# EAGLE design Radio Board (EAGLE 6.1)
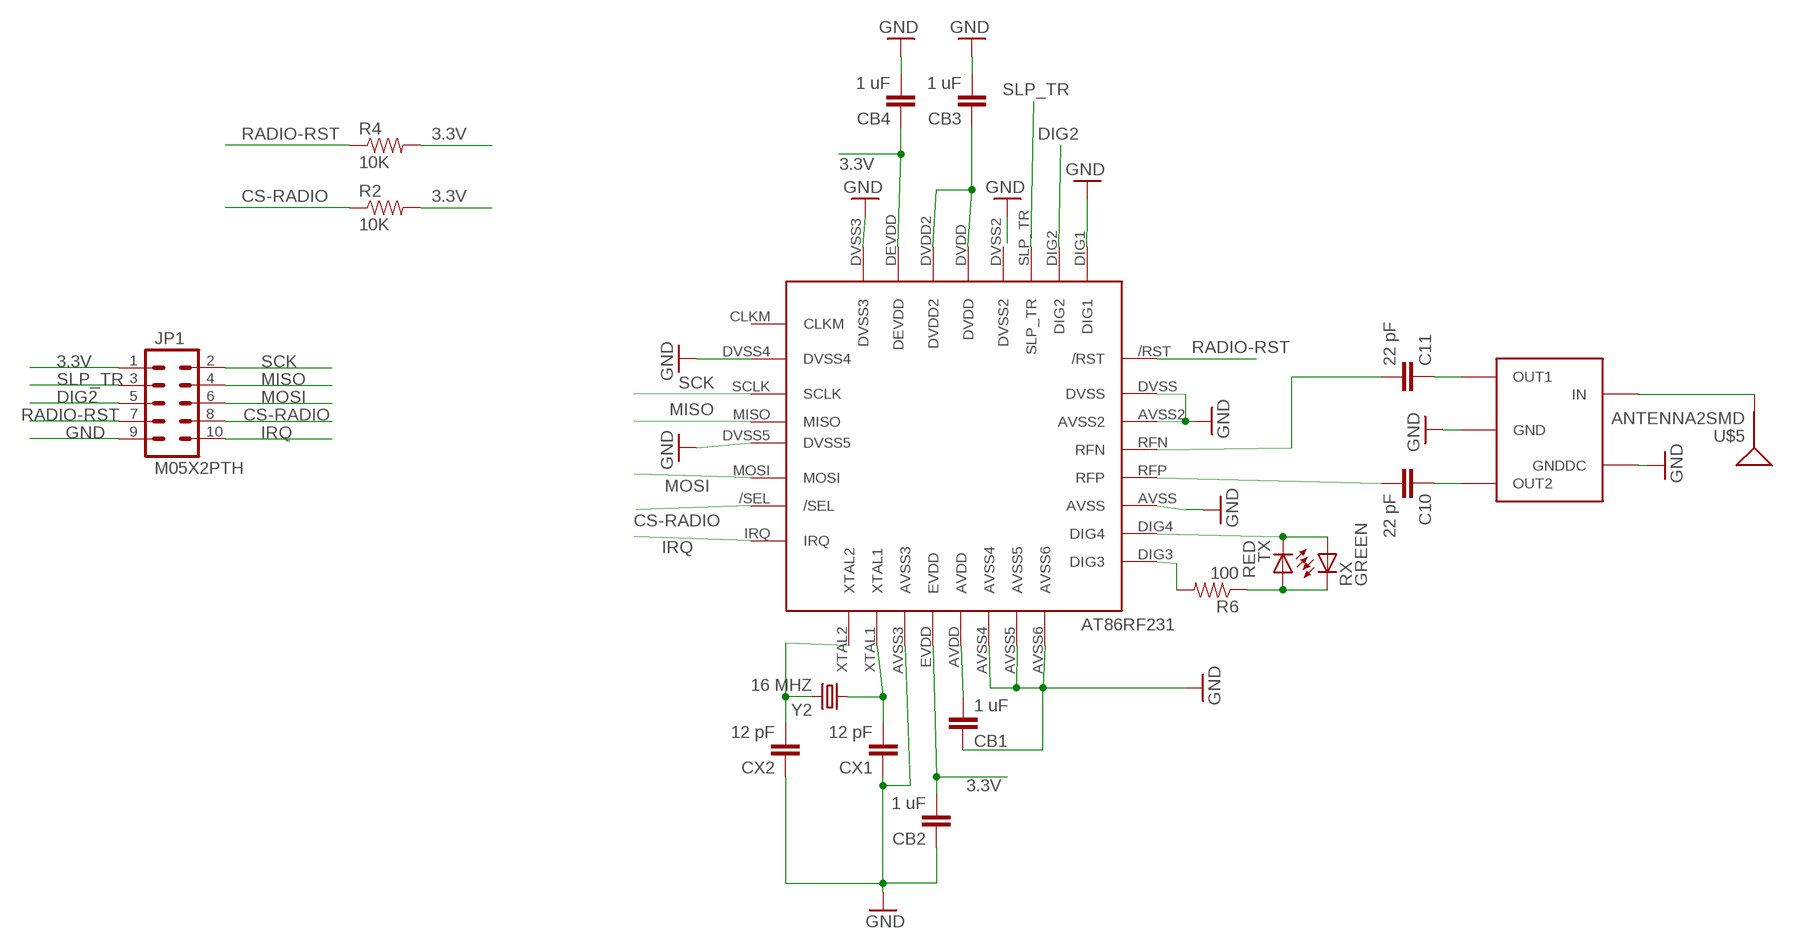
[diagram p0: schematic, sheet 1]

## Parts
C10  22 pF  CAP0603-CAP  [0603-CAP]
C11  22 pF  CAP0603-CAP  [0603-CAP]
CB1  1 uF  CAP0603-CAP  [0603-CAP]
CB2  1 uF  CAP0603-CAP  [0603-CAP]
CB3  1 uF  CAP0603-CAP  [0603-CAP]
CB4  1 uF  CAP0603-CAP  [0603-CAP]
CX1  12 pF  CAP0603-CAP  [0603-CAP]
CX2  12 pF  CAP0603-CAP  [0603-CAP]
JP1  M05X2PTH  [AVR_ICSP]
R2  10K  RESISTOR0603-RES  [0603-RES]
R4  10K  RESISTOR0603-RES  [0603-RES]
R6  100  RESISTOR0603-RES  [0603-RES]
RX  GREEN  LED0603  [LED-0603]
TX  RED  LED0603  [LED-0603]
U$3  AT86RF231(RADIO)AT86RF231  [32QN2(RADIO)]
U$4  WE-BAL  [WE-BAL]
U$5  ANTENNA2SMD  [ANTENNA-CHIP2]
Y2  16 MHZ  CRYSTALSMD  [HC49UP]

## Nets
3.3V: CB2.2 CB4.1 JP1.1 R2.2 R4.2 U$3.DEVDD U$3.EVDD
CS-RADIO: JP1.8 R2.1 U$3./SEL
DIG2: JP1.5 U$3.DIG2
GND: CB1.1 CB2.1 CB3.2 CB4.2 CX1.1 CX2.1 JP1.9 U$3.AVSS U$3.AVSS2 U$3.AVSS3 U$3.AVSS4 U$3.AVSS5 U$3.AVSS6 U$3.DIG1 U$3.DVSS U$3.DVSS3 U$3.DVSS4 U$3.DVSS5 U$4.GND U$4.GNDDC
IRQ: JP1.10 U$3.IRQ
MISO: JP1.4 U$3.MISO
MOSI: JP1.6 U$3.MOSI
N$9: CB3.1 U$3.DVDD U$3.DVDD2
N$10: CB1.2 U$3.AVDD
N$11: CX1.2 U$3.XTAL1 Y2.1
N$12: CX2.2 U$3.XTAL2 Y2.2
N$13: RX.A TX.C U$3.DIG4
N$14: R6.1 RX.C TX.A
N$15: R6.2 U$3.DIG3
N$16: C10.1 U$4.OUT2
N$17: C11.1 U$4.OUT1
N$18: C11.2 U$3.RFN
N$19: C10.2 U$3.RFP
N$20: U$4.IN U$5.FEED(SIGNAL)
RADIO-RST: JP1.7 R4.1 U$3./RST
SCK: JP1.2 U$3.SCLK
SLP_TR: JP1.3 U$3.SLP_TR
Unconnected: U$3.CLKM U$3.DVSS2

## Library data of the parts
C10 C11 CB1-CB4 CX1 CX2 = SparkFun:CAP: Capacitor Standard 0603 ceramic capacitor, and 0.1" leaded capacitor.
JP1 = SparkFun:M05X2: Header 5x2 Standard 10-pin dual row 0.1" header. Commonly used with AVR-ISP. Use with Spark Fun Electronics SKU: PRT-00778
R2 R4 R6 = SparkFun:RESISTOR: Resistor Basic schematic elements and footprints for 0603, 1206, and PTH resistors.
RX TX = SparkFun:LED: LEDs Standard schematic elements and footprints for 5mm, 3mm, 1206, and 0603 sized LEDs. 5mm - Spark Fun Electronics SKU : COM-00529 (and others)
U$3 = group10:AT86RF231(RADIO)
U$4 = group10:WE-BAL
U$5 = SparkFun:ANTENNA2: Antenna Single endded antenna. Common with smaller chip antennas. CHIP4 package is the GPS Chip Antenna SKU: GPS-08418. CHIP5 package is 2.4GHz chip antenna SKU: WRL-00144.
Y2 = group10:CRYSTAL: Crystals Various standard crystals. Proven footprints. Spark Fun Electronics SKU : COM-00534

## Net classes
1 Mini: width 0.25 mm

## Board
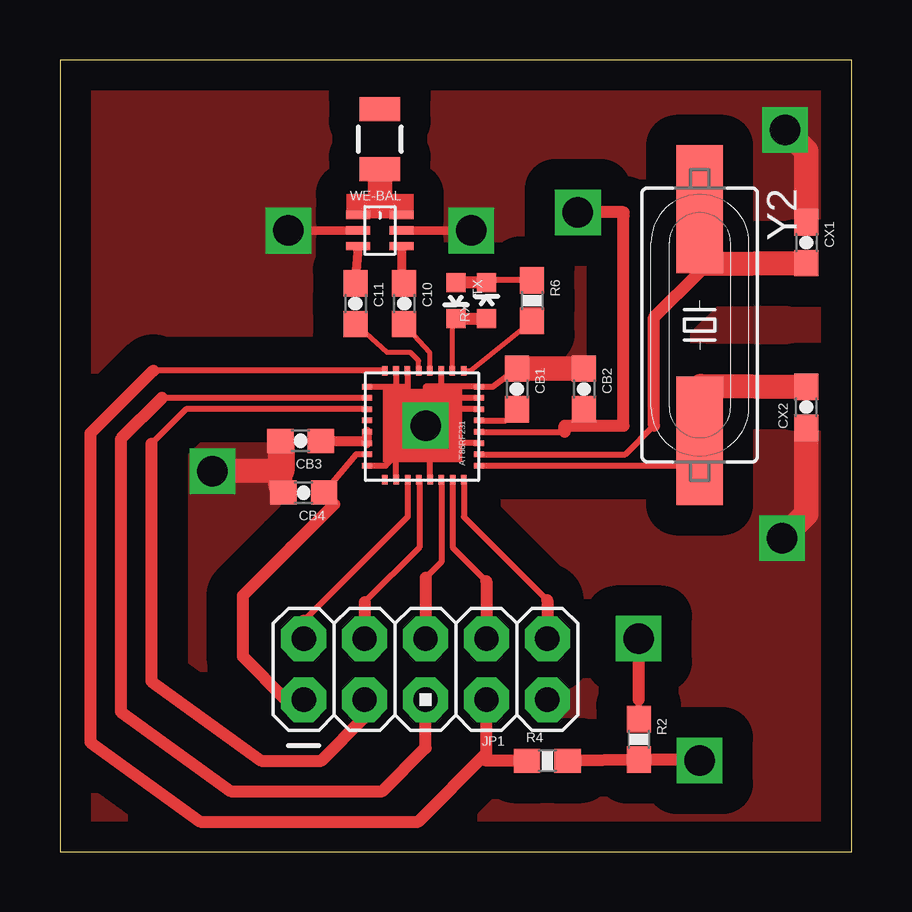
[diagram p1: board, top side]
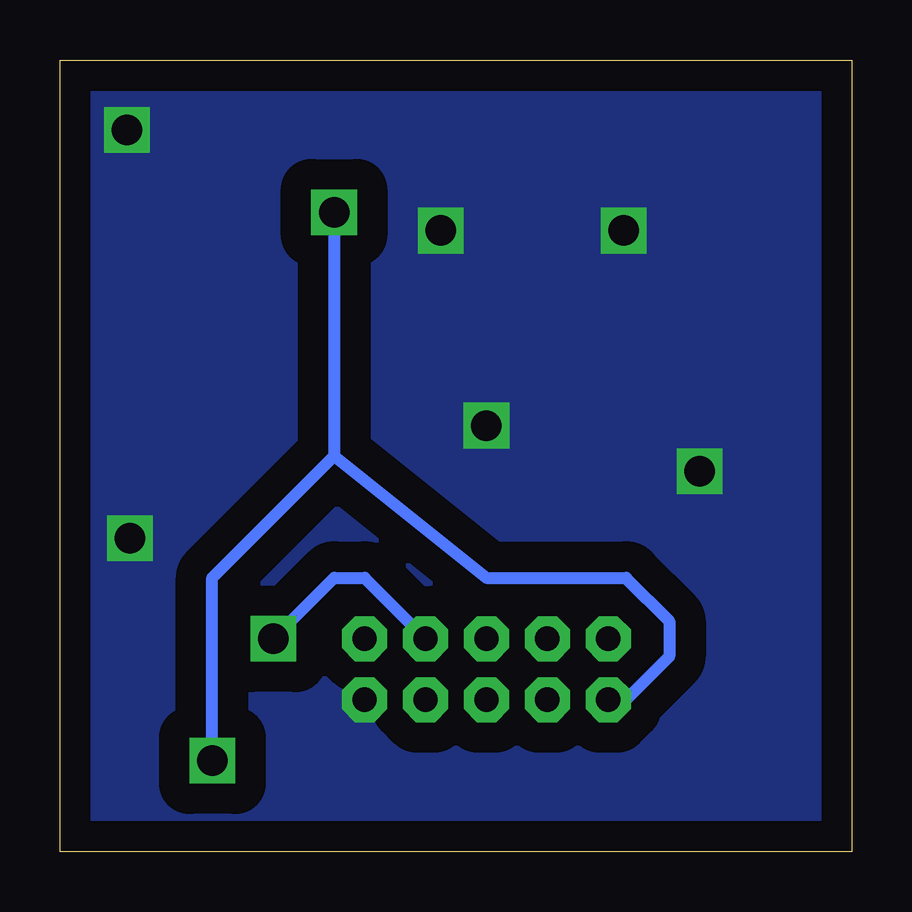
[diagram p2: board, bottom side, seen from below]

Size 33.02 x 33.02 mm. Coordinates in mm from the lower left corner, seen from the top.
Outline: 0,0 33.02,0 33.02,33.02 0,33.01 0,0
Copper layers (1*16): Top 0.035mm / dielectric 1.5mm / Bottom 0.035mm
Design rules: minimum track width 8mil, minimum drill 20mil, track to track 15mil, track to pad 15mil, pad to pad 15mil, via to via 15mil, smd to smd 0mil, copper to edge 10mil, drill to drill 8mil, minimum pad ring 12mil, minimum via ring 10mil, stop-mask expansion 4mil, vias tented up to drill 25mil, thermal gap 10mil

### Footprints (pad centres in the part's own frame; a part is rotated, then mirrored left to right if it is on the bottom)
0603-CAP = smd 1.1 x 1: 1 -0.85,0; 2 0.85,0
AVR_ICSP = drill 1.016 pad 1.88 octagon: 1 -1.27,5.08; 2 1.27,5.08; 3 -1.27,2.54; 4 1.27,2.54; 5 -1.27,0; 6 1.27,0; 7 -1.27,-2.54; 8 1.27,-2.54; 9 -1.27,-5.08; 10 1.27,-5.08
0603-RES = smd 1.1 x 1: 1 -0.85,0; 2 0.85,0
LED-0603 = smd 0.8 x 0.8: A 0,-0.75; C 0,0.75
32QN2(RADIO) = smd 0.4 x 0.23: /RST -2.29,-1.7; /SEL 2.26,1.13; AVSS -2.29,0.65; AVSS2 -2.29,-0.76; CLKM 2.26,-1.69; DIG3 -2.29,1.59; DIG4 -2.29,1.12; DVSS -2.29,-1.23; DVSS4 2.26,-1.22; DVSS5 2.26,0.19; IRQ 2.26,1.6; MISO 2.26,-0.28; MOSI 2.26,0.66; RFN -2.29,-0.29; RFP -2.29,0.18; SCLK 2.26,-0.75 | smd 0.23 x 0.4: AVDD -0.21,2.23; AVSS3 0.73,2.23; AVSS4 -0.68,2.23; AVSS5 -1.15,2.23; AVSS6 -1.62,2.23; DEVDD 1.2,-2.44; DIG1 -1.62,-2.44; DIG2 -1.15,-2.44; DVDD 0.26,-2.44; DVDD2 0.73,-2.44; DVSS2 -0.21,-2.44; DVSS3 1.67,-2.44; EVDD 0.26,2.23; SLP_TR -0.68,-2.44; XTAL1 1.2,2.23; XTAL2 1.67,2.23
WE-BAL = smd 1 x 0.35: GND 0.9,0; GNDDC -0.9,0; IN -0.9,0.65; NC 0.9,0.65; OUT1 -0.9,-0.65; OUT2 0.9,-0.65
ANTENNA-CHIP2 = smd 1.7 x 1: FEED 0,1.25; P$2 0,-1.25
HC49UP = smd 5.334 x 1.93: 1 -4.826,0; 2 4.826,0

### Placement (x,y rotation side)
C10  14.35,22.86 270 top
C11  12.32,22.86 270 top
CB1  19.05,19.3 270 top
CB2  21.84,19.3 270 top
CB3  10.03,17.14 180 top
CB4  10.16,14.99 180 top
CX1  31.11,25.4 270 top
CX2  31.11,18.54 90 top
JP1  15.24,7.62 90 top
R2  24.13,4.7 270 top
R4  20.32,3.81 0 top
R6  19.68,22.99 270 top
RX  17.78,22.99 0 top
TX  16.51,22.99 180 top
U$3  15.24,17.78 270 top
U$4  13.34,25.91 0 top
U$5  13.34,29.72 180 top
Y2  26.67,21.97 270 top

### Tracks (layer width: path | path; a pad name or v marks a point on that pad's centre or on a via)
3.3V  (via drill 1.27)
  Top 0.254: U$3.DEVDD 12.35,16.58 CB4.1 11.43,15.24 11.43,14.5 | U$3.EVDD 21.04,17.52 CB2.2
  Top 0.508: 21.04,17.52 21.04,17.78 23.5,17.78 23.5,26.52 23.5,26.67 v21.59,26.67 | 11.43,14.5 9.63,12.7 7.62,10.69 7.62,8.15 9.42,6.35 JP1.1 | v26.67,3.81 26.67,3.85 R2.2 R4.2
  Bottom 0.508: v21.59,26.67 21.59,16.51 | 21.59,16.51 15.24,11.43 9.42,11.43 7.62,9.63 7.62,8.15 9.42,6.35 JP1.1 | v26.67,3.81 26.67,11.43 21.59,16.51
CS-RADIO  (via drill 1.27)
  Top 0.254: U$3./SEL 16.37,12.7 17.78,11.29 | R2.1 24.13,6.35
  Top 0.508: 17.78,11.29 JP1.8 | 24.13,6.35 v24.13,8.89
  Bottom 0.508: v24.13,8.89 22.86,10.16 21.59,11.43 20.32,11.43 JP1.8
DIG2
  Top 0.254: U$3.DIG2 4.25,18.93
  Top 0.508: 4.25,18.93 2.54,17.22 2.54,5.85 7.12,2.54 13.44,2.54 15.24,4.34 JP1.5
GND  (via drill 1.27)
  Top 0.25: U$3.DVSS5 15.44,17.7 15.44,17.78 v15.24,17.78 | U$3.DIG1 14.38,19.4 14.38,19.38 v15.24,17.78 | U$3.DVSS4 14.02,15.57 14.02,16.56 | U$3.DVSS3 13.59,16.11 13.59,16.13 14.02,16.56 | 14.02,16.56 v15.24,17.78
  Top 0.254: U$4.GNDDC 12.06,25.91 | CB1.1 18.04,19.4 U$3.AVSS6 15.24,19.4 v15.24,17.78 | U$3.DVSS 14.01,17.78 v15.24,17.78 | U$3.AVSS2 14.48,17.78 v15.24,17.78 | U$3.AVSS 15.89,17.78 v15.24,17.78 | U$3.AVSS5 15.24,18.93 v15.24,17.78 | U$3.AVSS4 15.24,18.46 v15.24,17.78 | U$3.AVSS3 15.24,17.05 v15.24,17.78
  Top 0.356: 12.06,25.91 v9.53,25.91 | U$4.GND v17.14,25.91
  Top 1: CB3.2 9.27,17.14 9.27,15.88 v6.35,15.88
  Top 1.016: CB3.2 9.18,15.37 CB4.2 | CB2.1 CB1.1 | v30.1,13.08 31.11,14.1 CX2.1 | CX1.1 31.11,29.21 v30.23,30.1
  Bottom 0.508: 19.94,5.97 19.94,6.73 20.7,6.73 20.7,6.35 JP1.9
  pour Bottom (isolate 1.27, no thermals): 33.02,33.02 0,33.02 0,0 33.02,0
  pour Top (isolate 1.27, no thermals): 0,33.02 33.02,33.02 33.02,0 0,0
IRQ
  Top 0.254: U$3.IRQ 16.84,13.97 20.32,10.49
  Top 0.508: 20.32,10.49 JP1.10
MISO
  Top 0.2: U$3.MISO 14.98,15.5
  Top 0.254: 14.98,15.5 14.98,12.7 12.7,10.42
  Top 0.508: 12.7,10.42 JP1.4
MOSI
  Top 0.254: U$3.MOSI 15.9,12.09 15.24,11.43
  Top 0.508: 15.24,11.43 JP1.6
N$9
  Top 0.406: U$3.DVDD U$3.DVDD2 12.71,17.14 CB3.1
N$10
  Top 0.254: U$3.AVDD 18.59,17.99 CB1.2
N$11
  Top 0.254: 26.67,24.2 26.67,24.51 Y2.1 | U$3.XTAL1 23.57,16.58 24.77,17.78
  Top 0.508: 24.77,17.78 24.77,22.3 26.67,24.2
  Top 1.016: CX1.2 26.67,24.51 26.67,25.4 Y2.1
N$12
  Top 0.254: U$3.XTAL2 26.67,16.11 26.82,16.11
  Top 0.508: Y2.2 26.67,16.11
  Top 1.016: CX2.2 26.73,19.43 Y2.2
N$13
  Top 0.2: U$3.DIG4 16.36,22.09
  Top 0.406: 16.36,22.09 TX.C
  Top 0.508: TX.C RX.A
N$14
  Top 0.254: R6.1 17.88,23.84 RX.C
  Top 0.508: RX.C TX.A
N$15
  Top 0.2: U$3.DIG3 17.11,20.07 R6.2
N$16
  Top 0.254: 14.22,25.25 U$4.OUT2
  Top 0.381: U$4.OUT2 14.23,23.71 C10.1
N$17
  Top 0.254: 12.45,25.25 U$4.OUT1
  Top 0.381: C11.1 12.45,25.25
N$18
  Top 0.2: U$3.RFN 14.95,20.48 14.61,20.83 13.63,20.83 C11.2
N$19
  Top 0.2: U$3.RFP 15.42,20.81 C10.2
N$20
  Top 0.254: 13.34,27.46 U$4.IN
  Top 1.016: U$5.FEED 13.34,27.46
RADIO-RST
  Top 0.254: U$3./RST 3.89,20.07 | 17.78,4.11 JP1.7
  Top 0.508: 3.89,20.07 1.27,17.45 1.27,4.58 5.85,1.27 14.94,1.27 17.78,4.11 | R4.1 17.78,3.81 JP1.7
SCK
  Top 0.254: U$3.SCLK 14.49,13.97 10.16,9.64
  Top 0.508: 10.16,9.64 JP1.2
SLP_TR
  Top 0.254: U$3.SLP_TR 5.25,18.46 3.81,17.02
  Top 0.508: 3.81,17.02 3.81,7.12 8.39,3.81 10.9,3.81 12.7,5.61 JP1.3
(copper drawn outside any net)
  shapes: Bottom area x10, Top area x2